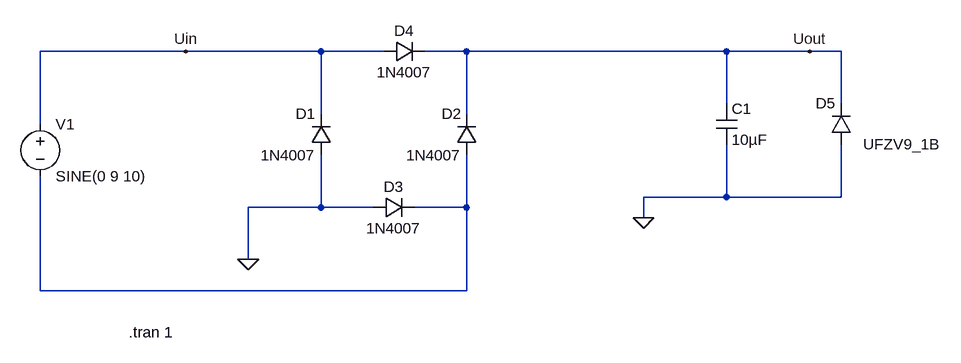
[diagram p0: schematic pont_graetz.asc]
pont_graetz.asc, the LTspice schematic file:
Version 4.1
SHEET 1 1404 680
WIRE 240 16 16 16
WIRE 448 16 240 16
WIRE 544 16 448 16
WIRE 672 16 608 16
WIRE 1072 16 672 16
WIRE 1200 16 1072 16
WIRE 1248 16 1200 16
WIRE 1072 96 1072 16
WIRE 1248 96 1248 16
WIRE 448 112 448 16
WIRE 672 112 672 16
WIRE 16 128 16 16
WIRE 1072 240 1072 160
WIRE 1072 240 944 240
WIRE 1248 240 1248 160
WIRE 1248 240 1072 240
WIRE 448 256 448 176
WIRE 448 256 336 256
WIRE 528 256 448 256
WIRE 672 256 672 176
WIRE 672 256 592 256
WIRE 944 272 944 240
WIRE 336 336 336 256
WIRE 16 384 16 208
WIRE 672 384 672 256
WIRE 672 384 16 384
FLAG 336 336 0
FLAG 944 272 0
FLAG 240 16 Uin
FLAG 1200 16 Uout
SYMBOL voltage 16 112 R0
WINDOW 123 0 0 Left 0
WINDOW 39 0 0 Left 0
SYMATTR InstName V1
SYMATTR Value SINE(0 9 10)
SYMBOL diode 464 176 R180
WINDOW 0 24 64 Left 2
WINDOW 3 24 0 Left 2
SYMATTR InstName D1
SYMATTR Value 1N4007
SYMBOL diode 688 176 R180
WINDOW 0 24 64 Left 2
WINDOW 3 24 0 Left 2
SYMATTR InstName D2
SYMATTR Value 1N4007
SYMBOL diode 544 32 R270
WINDOW 0 32 32 VTop 2
WINDOW 3 0 32 VBottom 2
SYMATTR InstName D4
SYMATTR Value 1N4007
SYMBOL diode 528 272 R270
WINDOW 0 32 32 VTop 2
WINDOW 3 0 32 VBottom 2
SYMATTR InstName D3
SYMATTR Value 1N4007
SYMBOL cap 1056 96 R0
SYMATTR InstName C1
SYMATTR Value 10µF
SYMBOL diode 1264 160 R180
WINDOW 0 24 64 Left 2
WINDOW 3 -137 1 Left 2
SYMATTR InstName D5
SYMATTR Value UFZV9_1B
TEXT 152 448 Left 2 !.tran 1

The netlist it stands for:
* pont_graetz.asc
V1 Uin N001 SINE(0 9 10)
D1 0 Uin 1N4007
D2 N001 Uout 1N4007
D4 Uin Uout 1N4007
D3 0 N001 1N4007
C1 Uout 0 10µF
D5 0 Uout UFZV9_1B
.model D D
.lib standard.dio
.tran 1
.backanno
.end

* Results of the author's LTspice run, read from the files saved beside the schematic
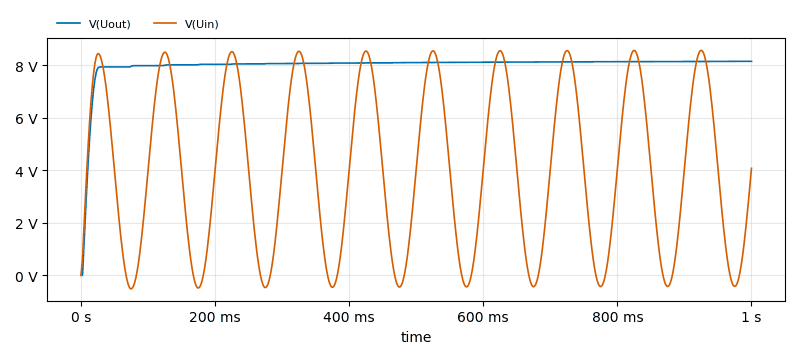
[diagram p1: Transient Analysis of pont_graetz.asc, plotted from the saved traces]
* Transient Analysis, 1 run:
*   V(Uout): min 0 V, max 8.158 V, average 8.004 V, rms 8.034 V, last 8.158 V
*   V(Uin): min -514.6 mV, max 8.575 V, average 4.002 V, rms 5.108 V, last 4.079 V